# EAGLE design Compact RF Circuit (EAGLE 8.3.0)
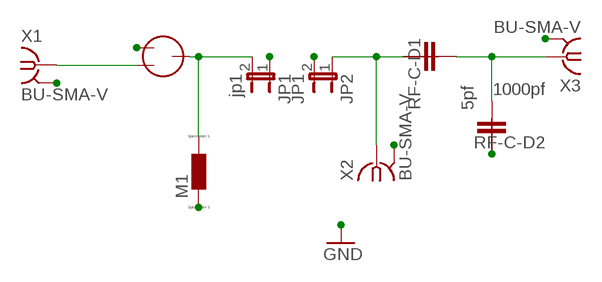
[diagram p0: schematic, sheet 1]

## Parts
JP1  jp1  JP1E  [JP1]
JP2  JP1  JP1E  [JP1]
M1  L  [L1812]
M2  ADJ-CAPACITORS9328-1  [9328]
RF-C-D1  5pf  RF-CAPACITORSMC22FD102J-F  [2220]
RF-C-D2  1000pf  RF-CAPACITORSMC22FD102J-F  [2220]
X1  BU-SMA-V  [BU-SMA-V]
X2  BU-SMA-V  [BU-SMA-V]
X3  BU-SMA-V  [BU-SMA-V]

## Nets
GND: JP1.1 JP2.2 M1.2 M2.P$1 RF-C-D2.P$1 X1.2 X1.3 X1.4 X1.5 X2.2 X2.3 X2.4 X2.5 X3.2 X3.3 X3.4 X3.5
N$3: M2.P$2 X1.1
N$4: JP1.2 M1.1 M2.P$3
N$10: JP2.1 RF-C-D1.P$1 X2.1
N$11: RF-C-D1.P$2 RF-C-D2.P$2 X3.1

## Library data of the parts
JP1 JP2 = jumper:JP1E: JUMPER
M1 = eagle-ltspice:L: INDUCTOR, European symbol; SPICEMODEL: NONE; SPICEPREFIX: L
M2 = Compact RF Amplifier:ADJ-CAPACITORS: 9328 - 微调电容, 12pF-100pF, 250V, 通孔安装
RF-C-D1 RF-C-D2 = Compact RF Amplifier:RF-CAPACITORS: 1210：型号：MC12CF050D-F 电容大小：5pf 1000v// 0603：型号：CBR06C509BAGAC 电容大小：5pf 250v// 2220：型号：MC22FD102J-F 电容大小：1000pf 500v// 1111：型号：VJ1111D102KXDAJ电容大小：1000pf 300v//
X1-X3 = con-coax:BU-SMA-V: FEMALE SMA CONNECTOR Radiall distributor RS 112-3794; OC_FARNELL: unknown; OC_NEWARK: unknown

## Board
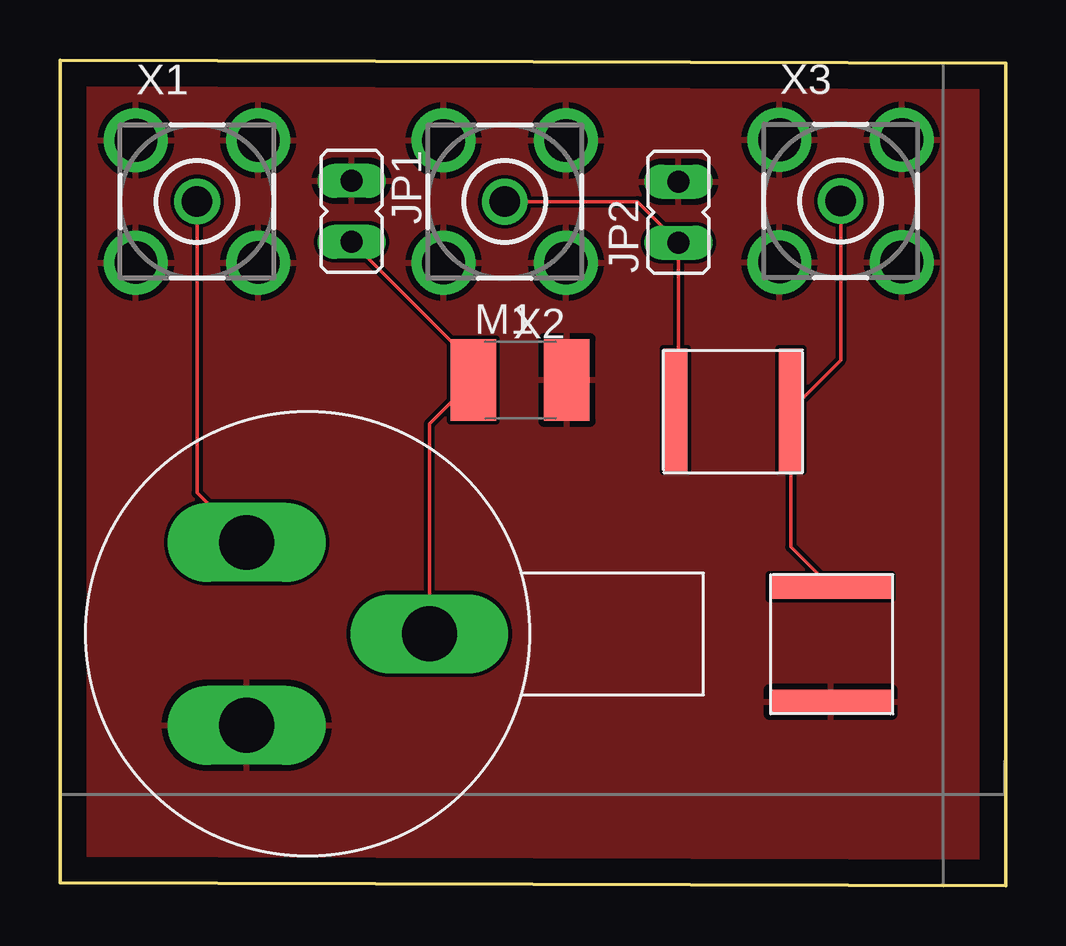
[diagram p1: board, top side]
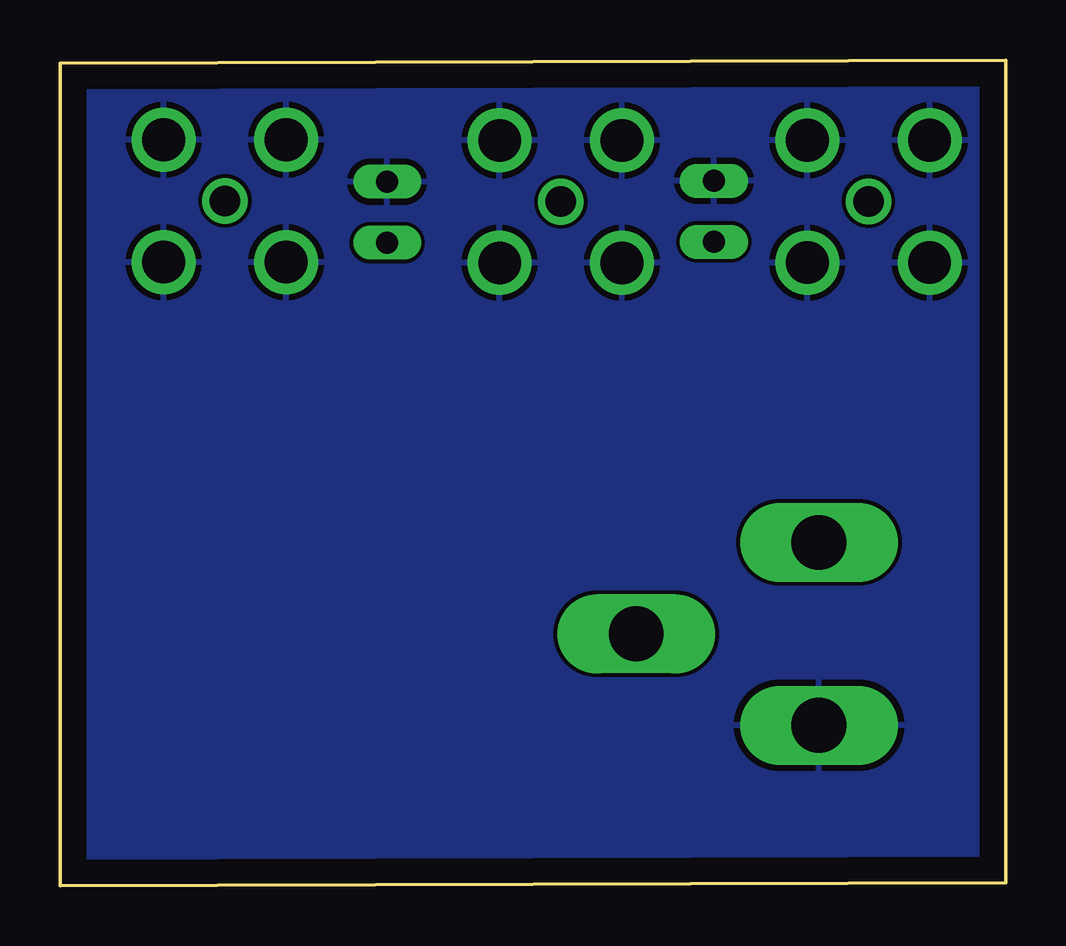
[diagram p2: board, bottom side, seen from below]

Size 39.42 x 34.41 mm. Coordinates in mm from the lower left corner, seen from the top.
Outline: 0,0.13 39.42,0 39.42,34.28 0,34.41 0,0.13
Copper layers (1*16): Top 0.035mm / dielectric 1.5mm / Bottom 0.035mm
Design rules "default": minimum track width 6mil, minimum drill 0.35mm, track to track 6mil, track to pad 6mil, pad to pad 6mil, via to via 6mil, smd to smd 6mil, copper to edge 40mil, drill to drill 6mil, minimum pad ring 10mil, minimum via ring 8mil, stop-mask expansion 4mil, vias tented up to drill 0mil, thermal gap 10mil

### Footprints (pad centres in the part's own frame; a part is rotated, then mirrored left to right if it is on the bottom)
JP1 = drill 0.914 long: 1 0,-1.27; 2 0,1.27
L1812 = smd 1.9 x 3.4: 1 -1.95,0; 2 1.95,0
9328 = drill 2.286 pad 3.048 long: P$1 -2.54,-5.08; P$2 -2.54,2.54; P$3 5.08,-1.27
2220 = smd 1 x 5.1: P$1 -4.5,-1.5; P$2 0.3,-1.5
BU-SMA-V = drill 1.27: 1 0,0 | drill 1.778: 2 -2.55,2.55; 3 2.55,2.55; 4 2.55,-2.55; 5 -2.55,-2.55

### Placement (x,y rotation side)
JP1  12.16,28.1 180 top
JP2  25.78,28.07 0 top
M1  19.18,21.07 0 top
M2  10.32,11.77 0 top
RF-C-D1  30.16,21.32 0 top
RF-C-D2  30.62,12.16 90 top
X1  5.71,28.51 0 top
X2  18.54,28.5 180 top
X3  32.55,28.53 0 top

### Tracks (layer width: path | path; a pad name or v marks a point on that pad's centre or on a via)
GND
  pour Top: 0.13,0.13 39.37,0.13 39.37,34.29 0,34.29 0,0.13
  pour Bottom: 0.13,0.13 39.37,0.13 39.37,34.16 0,34.16 0,0.13
N$3
  Top 0.152: X1.1 5.71,16.37 M2.P$2
N$4
  Top 0.152: M2.P$3 15.4,19.24 M1.1 17.23,21.76 JP1.2
N$10
  Top 0.152: X2.1 24.07,28.5 JP2.1 25.78,19.93 RF-C-D1.P$1
N$11
  Top 0.152: X3.1 32.55,21.9 RF-C-D1.P$2 30.46,14.12 RF-C-D2.P$2